# Altium schematic sheet RelayBoard.SchDoc: RelayBoard - MCU,  RS485, Opto, Relays
size A4; DocumentNumber: 1; Revision: 1; SheetNumber: 1; SheetTotal: 1
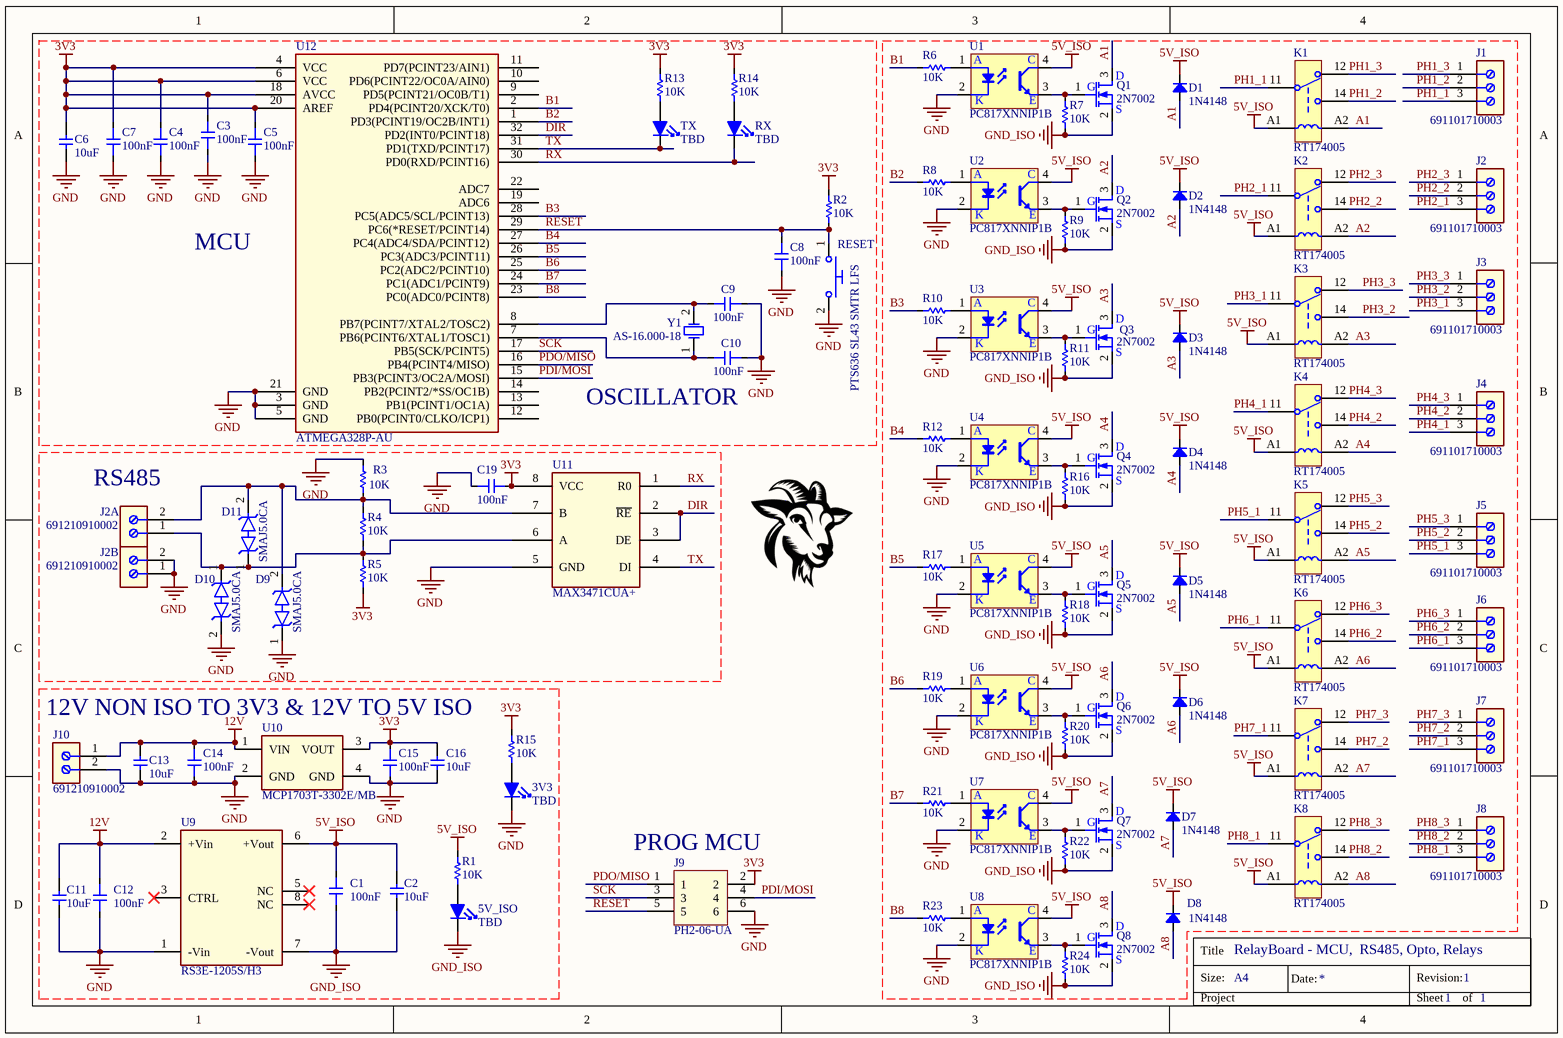
[diagram p0: RelayBoard.SchDoc]

## Parts
3V3  TBD  [CASE0603]
5V_ISO  TBD  [CASE0603]
C1  100nF  [CASE0603]
C2  10uF  [CASE0603]
C3  100nF  [CASE0603]
C4  100nF  [CASE0603]
C5  100nF  [CASE0603]
C6  10uF  [CASE0603]
C7  100nF  [CASE0603]
C8  100nF  [CASE0603]
C9  100nF  [CASE0603]
C10  100nF  [CASE0603]
C11  10uF  [CASE0603]
C12  100nF  [CASE0603]
C13  10uF  [CASE0603]
C14  100nF  [CASE0603]
C15  100nF  [CASE0603]
C16  10uF  [CASE0603]
C19  100nF  [CASE0603]
D1  1N4148  [SOD-323]
D2  1N4148  [SOD-323]
D3  1N4148  [SOD-323]
D4  1N4148  [SOD-323]
D5  1N4148  [SOD-323]
D6  1N4148  [SOD-323]
D7  1N4148  [SOD-323]
D8  1N4148  [SOD-323]
D9  SMAJ5.0CA  [SMA]
D10  SMAJ5.0CA  [SMA]
D11  SMAJ5.0CA  [SMA]
J1  691101710003  [691101710003]
J2  691101710003  [691101710003]
J2A  691210910002  [691210910002]
J2B  691210910002  [691210910002]
J3  691101710003  [691101710003]
J4  691101710003  [691101710003]
J5  691101710003  [691101710003]
J6  691101710003  [691101710003]
J7  691101710003  [691101710003]
J8  691101710003  [691101710003]
J9  PH2-06-UA  [Header_2x3_2.54_Male]
J10  691210910002  [691210910002]
K1  RT174005  [RELAY-SPDT_3.5mm]
K2  RT174005  [RELAY-SPDT_3.5mm]
K3  RT174005  [RELAY-SPDT_3.5mm]
K4  RT174005  [RELAY-SPDT_3.5mm]
K5  RT174005  [RELAY-SPDT_3.5mm]
K6  RT174005  [RELAY-SPDT_3.5mm]
K7  RT174005  [RELAY-SPDT_3.5mm]
K8  RT174005  [RELAY-SPDT_3.5mm]
Q1  2N7002  [SOT23-3]
Q2  2N7002  [SOT23-3]
Q3  2N7002  [SOT23-3]
Q4  2N7002  [SOT23-3]
Q5  2N7002  [SOT23-3]
Q6  2N7002  [SOT23-3]
Q7  2N7002  [SOT23-3]
Q8  2N7002  [SOT23-3]
R1  10K  [CASE0603]
R2  10K  [CASE0603]
R3  10K  [CASE0603]
R4  10K  [CASE0603]
R5  10K  [CASE0603]
R6  10K  [CASE0603]
R7  10K  [CASE0603]
R8  10K  [CASE0603]
R9  10K  [CASE0603]
R10  10K  [CASE0603]
R11  10K  [CASE0603]
R12  10K  [CASE0603]
R13  10K  [CASE0603]
R14  10K  [CASE0603]
R15  10K  [CASE0603]
R16  10K  [CASE0603]
R17  10K  [CASE0603]
R18  10K  [CASE0603]
R19  10K  [CASE0603]
R20  10K  [CASE0603]
R21  10K  [CASE0603]
R22  10K  [CASE0603]
R23  10K  [CASE0603]
R24  10K  [CASE0603]
RESET  PTS636 SL43 SMTR LFS  [SMT Button]
RX  TBD  [CASE0603]
TX  TBD  [CASE0603]
U1  PC817XNNIP1B  [SMD-4]
U2  PC817XNNIP1B  [SMD-4]
U3  PC817XNNIP1B  [SMD-4]
U4  PC817XNNIP1B  [SMD-4]
U5  PC817XNNIP1B  [SMD-4]
U6  PC817XNNIP1B  [SMD-4]
U7  PC817XNNIP1B  [SMD-4]
U8  PC817XNNIP1B  [SMD-4]
U9  RS3E-1205S/H3  [SIP-8]
U10  MCP1703T-3302E/MB  [SOT-223-3]
U11  MAX3471CUA+  [TSSOP-8]
U12  ATMEGA328P-AU  [TQFP-32]
Y1  AS-16.000-18  [HC-49/US]

## Nets
3V3: C3.2 C4.2 C5.2 C6.2 C7.2 C15.2 C16.2 C19.1 J9.2 R2.1 R5.2 R13.1 R14.1 R15.1 U10.3(VOUT) U11.8(VCC) U12.4(VCC) U12.6(VCC) U12.18(AVCC) U12.20(AREF)
5V_ISO: C1.2 C2.2 D1.K D2.K D3.K D4.K D5.K D6.K D7.K D8.K K1.A1 K2.A1 K3.A1 K4.A1 K5.A1 K6.A1 K7.A1 K8.A1 R1.1 U1.4(C) U2.4(C) U3.4(C) U4.4(C) U5.4(C) U6.4(C) U7.4(C) U8.4(C) U9.6(+Vout)
12V: C11.2 C12.2 C13.2 C14.2 J10.1 U9.2(+Vin) U10.1(VIN)
GND: 3V3.2(K) C3.1 C4.1 C5.1 C6.1 C7.1 C8.2 C9.1 C10.1 C11.1 C12.1 C13.1 C14.1 C15.1 C16.1 C19.2 D9.1 D10.2 J2B.1 J2B.2 J9.6 J10.2 R3.1 RESET.2 U1.2(K) U2.2(K) U3.2(K) U4.2(K) U5.2(K) U6.2(K) U7.2(K) U8.2(K) U9.1(-Vin) U10.2(GND) U10.4(GND) U11.5(GND) U12.3(GND) U12.5(GND) U12.21(GND)
GND_ISO: 5V_ISO.2(K) C1.1 C2.1 Q1.2(S) Q2.2(S) Q3.2(S) Q4.2(S) Q5.2(S) Q6.2(S) Q7.2(S) Q8.2(S) R7.1 R9.1 R11.1 R16.1 R18.1 R20.1 R22.1 R24.1 U9.7(-Vout)
A1: D1.A K1.A2 Q1.3(D)
A2: D2.A K2.A2 Q2.3(D)
A3: D3.A K3.A2 Q3.3(D)
A4: D4.A K4.A2 Q4.3(D)
A5: D5.A K5.A2 Q5.3(D)
A6: D6.A K6.A2 Q6.3(D)
A7: D7.A K7.A2 Q7.3(D)
A8: D8.A K8.A2 Q8.3(D)
B1: R6.1 U12.2(PD4(PCINT20/XCK/T0))
B2: R8.1 U12.1(PD3(PCINT19/OC2B/INT1))
B3: R10.1 U12.28(PC5(ADC5/SCL/PCINT13))
B4: R12.1 U12.27(PC4(ADC4/SDA/PCINT12))
B5: R17.1 U12.26(PC3(ADC3/PCINT11))
B6: R19.1 U12.25(PC2(ADC2/PCINT10))
B7: R21.1 U12.24(PC1(ADC1/PCINT9))
B8: R23.1 U12.23(PC0(ADC0/PCINT8))
DIR: U11.2(~{RE}) U11.3(DE) U12.32(PD2(INT0/PCINT18))
PDI/MOSI: J9.4 U12.15(PB3(PCINT3/OC2A/MOSI))
PDO/MISO: J9.1 U12.16(PB4(PCINT4/MISO))
PH1_1: J1.3 K1.11
PH1_2: J1.2 K1.14
PH1_3: J1.1 K1.12
PH2_1: J2.3 K2.11
PH2_2: J2.2 K2.14
PH2_3: J2.1 K2.12
PH3_1: J3.3 K3.11
PH3_2: J3.2 K3.14
PH3_3: J3.1 K3.12
PH4_1: J4.3 K4.11
PH4_2: J4.2 K4.14
PH4_3: J4.1 K4.12
PH5_1: J5.3 K5.11
PH5_2: J5.2 K5.14
PH5_3: J5.1 K5.12
PH6_1: J6.3 K6.11
PH6_2: J6.2 K6.14
PH6_3: J6.1 K6.12
PH7_1: J7.3 K7.11
PH7_2: J7.2 K7.14
PH7_3: J7.1 K7.12
PH8_1: J8.3 K8.11
PH8_2: J8.2 K8.14
PH8_3: J8.1 K8.12
~{RESET}: C8.1 J9.5 R2.2 RESET.1 U12.29(PC6(*RESET/PCINT14))
RX: RX.2(K) U11.1(R0) U12.30(PD0(RXD/PCINT16))
SCK: J9.3 U12.17(PB5(SCK/PCINT5))
TX: TX.2(K) U11.4(DI) U12.31(PD1(TXD/PCINT17))
Net3V3_1: 3V3.1(A) R15.2
Net5V_ISO_1: 5V_ISO.1(A) R1.2
NetC9_2: C9.2 U12.8(PB7(PCINT7/XTAL2/TOSC2)) Y1.2(OSC2)
NetC10_2: C10.2 U12.7(PB6(PCINT6/XTAL1/TOSC1)) Y1.1(OSC1)
NetD9_2: D9.2 D11.2 J2A.2 R3.2 R4.1 U11.7(B)
NetD10_1: D10.1 D11.1 J2A.1 R4.2 R5.1 U11.6(A)
NetQ1_1: Q1.1(G) R7.2 U1.3(E)
NetQ2_1: Q2.1(G) R9.2 U2.3(E)
NetQ3_1: Q3.1(G) R11.2 U3.3(E)
NetQ4_1: Q4.1(G) R16.2 U4.3(E)
NetQ5_1: Q5.1(G) R18.2 U5.3(E)
NetQ6_1: Q6.1(G) R20.2 U6.3(E)
NetQ7_1: Q7.1(G) R22.2 U7.3(E)
NetQ8_1: Q8.1(G) R24.2 U8.3(E)
NetR6_2: R6.2 U1.1(A)
NetR8_2: R8.2 U2.1(A)
NetR10_2: R10.2 U3.1(A)
NetR12_2: R12.2 U4.1(A)
NetR13_2: R13.2 TX.1(A)
NetR14_2: R14.2 RX.1(A)
NetR17_2: R17.2 U5.1(A)
NetR19_2: R19.2 U6.1(A)
NetR21_2: R21.2 U7.1(A)
NetR23_2: R23.2 U8.1(A)

Not connected (* = marked no-connect by the designer): U9 3(CTRL)* 5(NC)* 8(NC)*; U12 9(PD5(PCINT21/OC0B/T1)) 10(PD6(PCINT22/OC0A/AIN0)) 11(PD7(PCINT23/AIN1)) 12(PB0(PCINT0/CLKO/ICP1)) 13(PB1(PCINT1/OC1A)) 14(PB2(PCINT2/*SS/OC1B)) 19(ADC6) 22(ADC7)

## Notes on the sheet
- MCU
- (near C10) OSCILLATOR
- (near J2A) RS485
- 12V NON ISO TO 3V3 & 12V TO 5V ISO
- (near J9) PROG MCU
- Title
- Size:
- A4
- Date:
- Revision:
- Project
- Sheet
- of

## Library data of the parts
3V3 5V_ISO RX TX = LED: Typical INFRARED GaAs LED
C1 C3-C5 C7-C10 C12 C14 C15 C19 = Capacitor_100nF: CAP CER 100nF 5% 25V X7R 0603; MFR: KEMET; MFR PN: C0603C104J3RAC; Supplier: Mouser; Supplier PN: 80-C0603C104J3RAC; Datasheet: https://eu.mouser.com/ProductDetail/KEMET/C0603C104J3RAC?qs=zlI8QACJnq%252BcGF637t1xBQ%3D%3D
C2 C6 C11 C13 C16 = Capacitor_10uF: CAP CER 10uF 20% 25V X5R 0603; MFR: TDK; MFR PN: C1608X5R1E106M080AC; Supplier: Mouser; Supplier PN: 810-C1608X5R1E106M; Datasheet: https://eu.mouser.com/ProductDetail/TDK/C1608X5R1E106M080AC?qs=dfay7wIA1uGdHfZTkqsICA%3D%3D
D1-D8 = Diode 1N4148: High Conductance Fast Diode; MFR PN: 1N4148WX-TP; MFR: Micro Commercial Components (MCC); ComponentLink1Description: Manufacturer Link; ComponentLink1URL: http://www.fairchildsemi.com/; ComponentLink2Description: Datasheet; ComponentLink2URL: http://www.fairchildsemi.com/ds/1N%2F1N4148.pdf; Supplier: Mouser; Supplier PN: 833-1N4148WX-TP; Datasheet: https://eu.mouser.com/ProductDetail/Micro-Commercial-Components-MCC/1N4148WX-TP?qs=Vo7e0yZOYdH7fKyVBspYOg%3D%3D
D9-D11 = Diode_SMAJ5.0CA: 9.2V Clamp 43.5A Ipp Tvs Diode Surface Mount DO-214AC (SMA); MFR: Good-Ark Semiconductor; Datasheet: https://www.digikey.ro/en/products/detail/good-ark-semiconductor/SMAJ5-0CA/18649098; MFR PN: SMAJ5.0CA; Supplier: Digi Key; Supplier PN: 4786-SMAJ5.0CACT-ND
J1-J8 = Connector_691101710003: TERM BLOCK 3P HORIZON 5MM PCB; MFR: Wurth; Datasheet: https://www.digikey.ro/en/products/detail/w%C3%BCrth-elektronik/691210910002/10668428?s=N4IgTCBcDaIGwE4CMYkAZlqxAugXyA; MFR PN: 691101710003; Supplier PN: 732-2027-ND; Supplier: Digi Key
J2A J2B J10 = Connector_691210910002: TERM BLOCK 2P HORIZON 2.54MM PCB; MFR: Wurth; Datasheet: https://www.digikey.ro/en/products/detail/w%C3%BCrth-elektronik/691210910002/10668428?s=N4IgTCBcDaIGwE4CMYkAZlqxAugXyA; MFR PN: 691210910002; Supplier PN: 732-691210910002-ND; Supplier: Digi Key
J9 = Connector_PH2-06-UA: Connector Header Through Hole 6 position 0.100" (2.54mm); MFR: Adam Tech; MFR PN: PH2-06-UA; Supplier: Digi Key; Supplier PN: 2057-PH2-06-UA-ND; Datasheet: https://www.digikey.ro/en/products/detail/adam-tech/PH2-06-UA/9830396
K1-K8 = Relay_RT174005: RELAY GEN PURPOSE SPDT 10A 5V; MFR: TE; MFR PN: RT174005; Supplier: DigiKey; Supplier PN: RT174005-ND; Datasheet: https://www.digikey.ro/en/products/detail/te-connectivity-potter-brumfield-relays/RT174005/1128621
Q1-Q8 = Transistor_NMOS: MOSFET N-CH 60V 280MA SOT23-3; MFR: Microchip; MFR PN: 2N7002-G; Supplier: 689-2N7002-G; Supplier PN: 689-2N7002-G; Datasheetr: https://eu.mouser.com/ProductDetail/Microchip-Technology/2N7002-G?qs=D%2FHwGy7fPj%2F0m3YgJ%252BOEvg%3D%3D&gad_source=1&gclid=CjwKCAiA-vOsBhAAEiwAIWR0TUe7q_QostOicZHu1AHXgQXTk64doIjIByY-NhPhM9vjgvrvT5qG4BoC-HkQAvD_BwE&_gl=1*1hvi63b*_ga*MjAyNjQwOTA4MS4xNzA0NjI4Mjkx*_ga_15W4STQT4T*MTcwNDgyMjg3Ni4yLjEuMTcwNDgyMjg3Ni42MC4wLjA.
R1-R24 = Resistor_10K_0603: RES 10K 1% 1/10W 0603; MFR: YAGEO; MFR PN: RC0603FR-0710KL; Supplier: Mouser; Supplier PN: 603-RC0603FR-0710KL; Datasheet: https://eu.mouser.com/ProductDetail/YAGEO/RC0603FR-0710KL?qs=grNVn54RoB%252B3GtjbJj3wJQ%3D%3D
RESET = Button_PTS636 SL43 SMTR LFS: 9.2V Clamp 43.5A Ipp Tvs Diode Surface Mount DO-214AC (SMA); MFR: C&K; Datasheet: https://www.digikey.ro/en/products/detail/c-k/PTS636-SL43-SMTR-LFS/10071722; MFR PN: PTS636 SL43 SMTR LFS; Supplier: Digi Key; Supplier PN: CKN12309-1-ND
U1-U8 = Optocoupler_PC817: 4-Pin Phototransistor Optocoupler; MFR: Sharp Microelectronics; MFR PN: PC817XNNIP1B; Supplier: 852-PC817XNNIP1B; Supplier PN: Mouser; Datasheet: https://eu.mouser.com/ProductDetail/Sharp-Microelectronics/PC817XNNIP1B?qs=rrS6PyfT74dJvnx7366b6Q%3D%3D
U9 = Module_RS3E-1205S/H3: DC DC CONVERTER 9-18V IN 5V OUT 600mA 3W; MFR: Recom Power; MFR PN: RS3E-1205S/H3; Supplier: DigiKey; Supplier PN: 945-RS3E-1205S/H3-ND; Datasheet: https://www.digikey.ro/en/products/detail/recom-power/RS3E-1205S-H3/14308292?s=N4IgTCBcDaIEoGUDMBRAtARjABgKwIHoAJJEAXQF8g
U10 = MCP1703T-3302E/MB: IC REG LINEAR 3.3V 250MA SOT89-3; MFR: Microchip; MFR PN: MCP1703T-3302E/MB; Supplier: Digi Key; Supplier PN: MCP1703T-3302E/MBCT-ND; Datasheet: https://www.digikey.ro/en/products/detail/microchip-technology/MCP1703T-3302E-MB/1635604
U11 = IC_MAX3471: IC TRANSCEIVER HALF 1/1 8UMAX; MFR: Analog Devices; Datasheet: https://www.digikey.com/en/products/detail/analog-devices-inc-maxim-integrated/max3471cua/1702211; MFR PN: MAX3471CUA+; Supplier: Digi Key; Supplier PN: MAX3471CUA+-ND
U12 = IC_ATMEGA328: AVR AVR® ATmega Microcontroller IC 8-Bit 20MHz 32KB (16K x 16) FLASH 32-TQFP (7x7); MFR PN: Microchip; MFR: ATMEGA328P-AU; Supplier: Digi Key; Supplier PN: ATMEGA328P-AU-ND; Datasheet: https://www.digikey.com/en/products/detail/microchip-technology/ATMEGA328P-AU/1832260
Y1 = Crystal_AS-16.000-18: 16 MHz ±30ppm Crystal 18pF 40 Ohms HC-49/US; MFR: Raltron Electronics; MFR PN: AS-16.000-18; Datasheet: https://www.digikey.ro/en/products/detail/raltron-electronics/AS-16-000-18/10271769; Supplier PN: 2151-AS-16.000-18-ND; Supplier: Digi Key